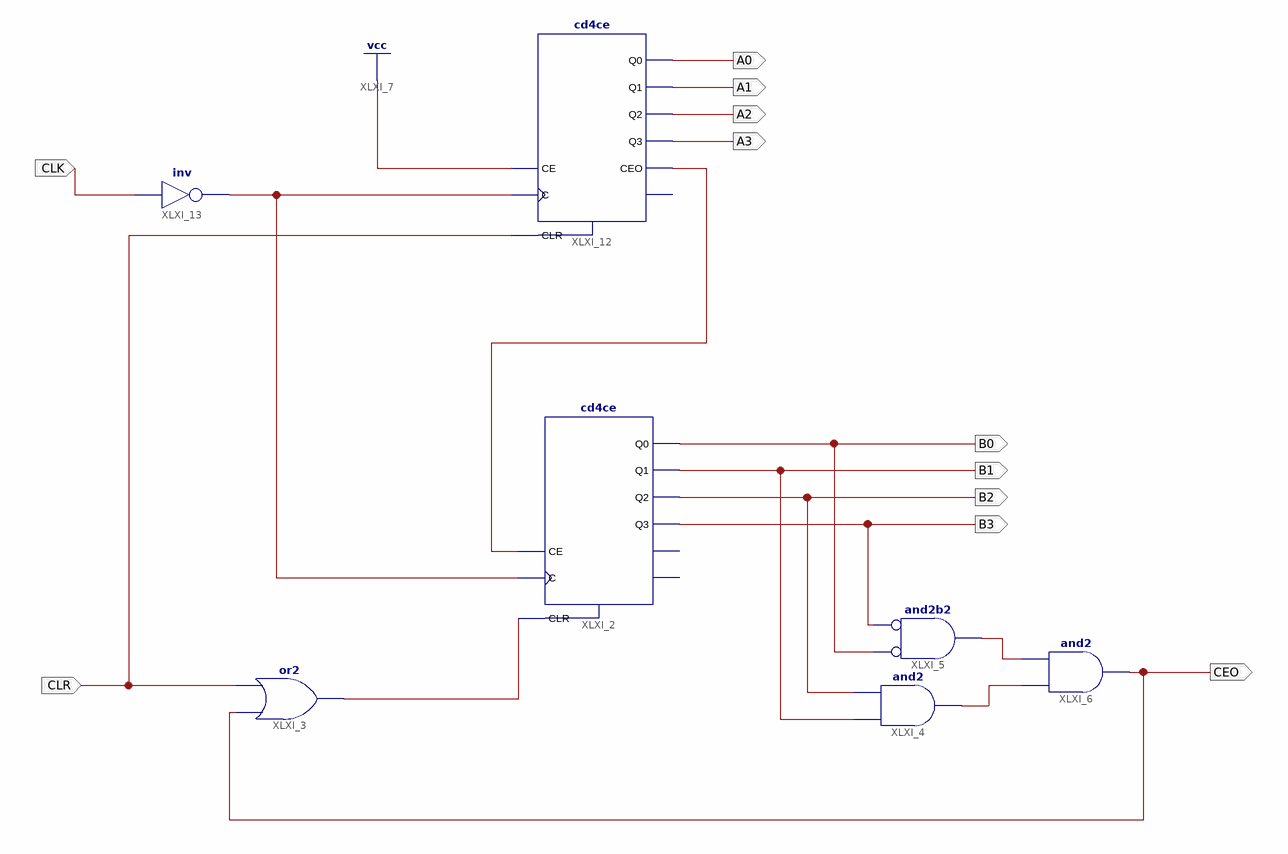
[diagram p0: schematic sheet 1]
// Xilinx ISE schematic SEC_COUNTER.sch (spartan6) as structural Verilog: 7 symbols, 11 ports
module SEC_COUNTER (
  input  CLR,
  input  CLK,
  output B2,
  output B3,
  output B1,
  output B0,
  output CEO,
  output A0,
  output A1,
  output A2,
  output A3
);

  wire XLXN_9, XLXN_10, XLXN_31, XLXN_35, XLXN_40;

  cd4ce XLXI_2 (.C(XLXN_40), .CE(XLXN_31), .CLR(XLXN_35), .Q0(B0), .Q1(B1), .Q2(B2), .Q3(B3));  // open: CEO, TC
  or XLXI_3 (XLXN_35, CEO, CLR);
  and XLXI_4 (XLXN_10, B1, B2);
  and XLXI_5 (XLXN_9, ~B0, ~B3);  // and2b2
  and XLXI_6 (CEO, XLXN_10, XLXN_9);
  cd4ce XLXI_12 (.C(XLXN_40), .CE(1'b1), .CLR(CLR), .CEO(XLXN_31), .Q0(A0), .Q1(A1), .Q2(A2), .Q3(A3));  // open: TC
  not XLXI_13 (XLXN_40, CLK);
endmodule
